# EAGLE design fan-host-board-v1.0 (EAGLE 9.6.2)
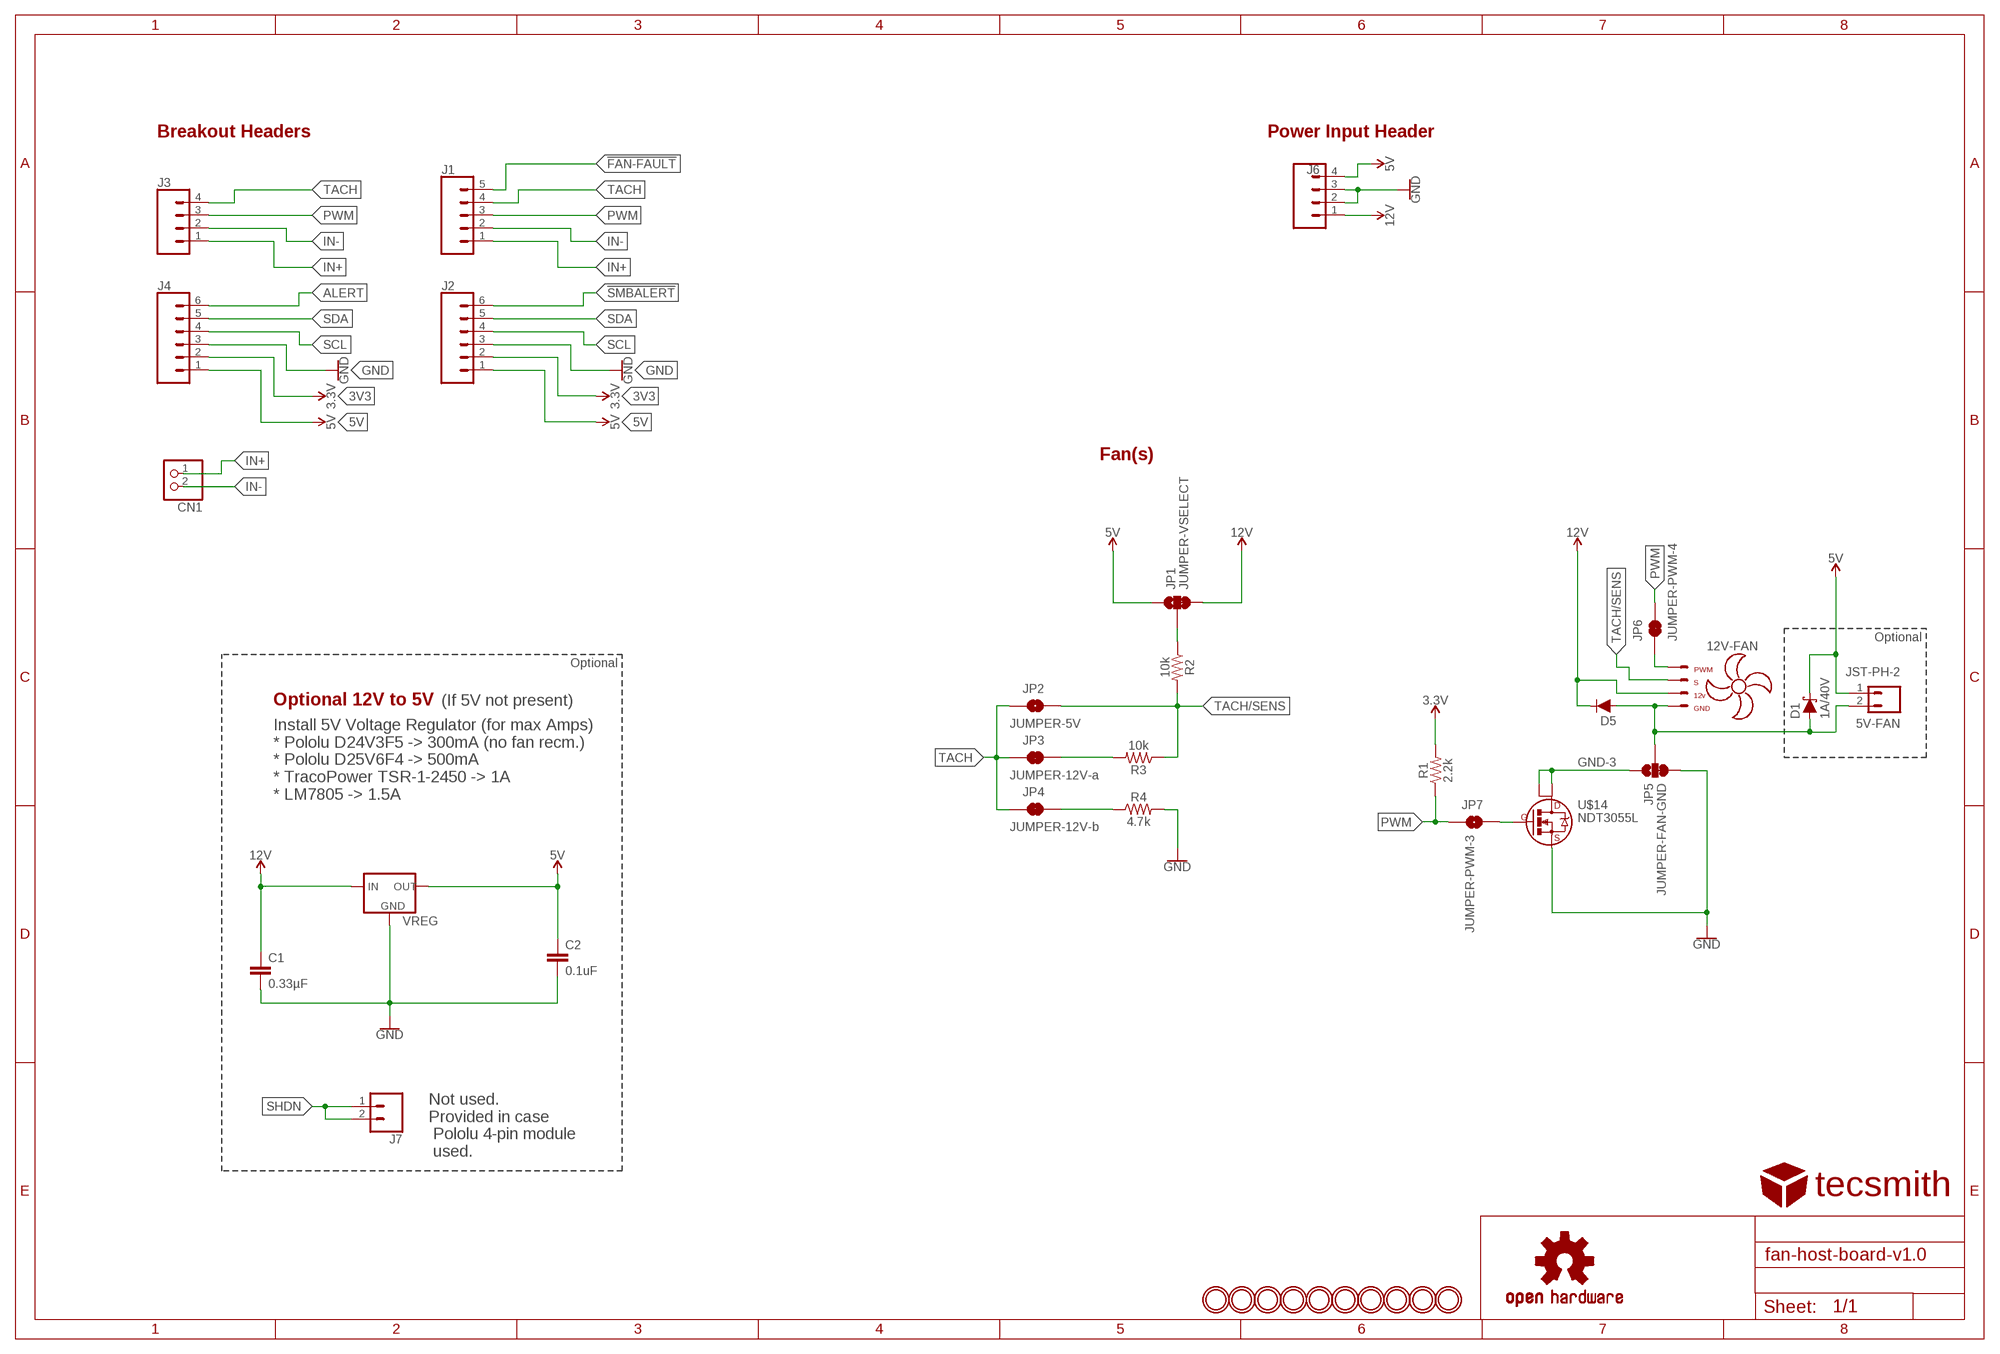
[diagram p0: schematic, sheet 1]

## Parts
5V-FAN  JST-PH-2  [JST-PH2]
12V-FAN  KK-254-4KK-254  [MOLEX_47053-1000]
C1  0.33µF  0.33UF/330NF-0805-50V-10%  [0805]
C2  0.1uF  0.1UF-0603-25V-5%  [0603]
CN1  JST_2PIN-THM  [JST-PH-2-THM]
D1  1A/40V  DIODE-SCHOTTKY-SS14  [SMA-DIODE]
D5  200mA/100V  DIODE-1N4148  [DIODE-1N4148]
J1  CONN_05  [1X05]
J2  CONN_06SILK_FEMALE_PTH  [1X06]
J3  CONN_04PTH  [1X04]
J4  CONN_06SILK_FEMALE_PTH  [1X06]
J6  CONN_04SCREW  [SCREWTERMINAL-3.5MM-4]
J7  CONN_021X02_NO_SILK  [1X02_NO_SILK]
JP1  JUMPER-VSELECT  JUMPER-SMT_3_1-NC_TRACE_SILK  [SMT-JUMPER_3_1-NC_TRACE_SILK]
JP2  JUMPER-5V  JUMPER-SMT_2_NO_NO_SILK  [SMT-JUMPER_2_NO_SILK]
JP3  JUMPER-12V-a  JUMPER-SMT_2_NC_TRACE_SILK  [SMT-JUMPER_2_NC_TRACE_SILK]
JP4  JUMPER-12V-b  JUMPER-SMT_2_NC_TRACE_SILK  [SMT-JUMPER_2_NC_TRACE_SILK]
JP5  JUMPER-FAN-GND  JUMPER-SMT_3_1-NC_TRACE_SILK  [SMT-JUMPER_3_1-NC_TRACE_SILK]
JP6  JUMPER-PWM-4  JUMPER-SMT_2_NC_TRACE_SILK  [SMT-JUMPER_2_NC_TRACE_SILK]
JP7  JUMPER-PWM-3  JUMPER-SMT_2_NO_NO_SILK  [SMT-JUMPER_2_NO_SILK]
LOGO1  OSHW-LOGOS  [OSHW-LOGO-S]
R1  2.2k  2.2KOHM-0603-1/10W-1%  [0603]
R2  10k  10KOHM-0603-1/10W-1%  [0603]
R3  10k  10KOHM-0603-1/10W-1%  [0603]
R4  4.7k  4.7KOHM-0603-1/10W-1%  [0603]
U$1  TECSMITH-LOGO  [TECSMITH-LOGO]
U$3  MOUNTINGHOLE2.5  [MOUNTINGHOLE_2.5_PLATED]
U$4  MOUNTINGHOLE2.5  [MOUNTINGHOLE_2.5_PLATED]
U$5  MOUNTINGHOLE2.5  [MOUNTINGHOLE_2.5_PLATED]
U$6  MOUNTINGHOLE2.5  [MOUNTINGHOLE_2.5_PLATED]
U$7  MOUNTINGHOLE2.5  [MOUNTINGHOLE_2.5_PLATED]
U$8  MOUNTINGHOLE2.5  [MOUNTINGHOLE_2.5_PLATED]
U$9  MOUNTINGHOLE2.5  [MOUNTINGHOLE_2.5_PLATED]
U$10  MOUNTINGHOLE2.5  [MOUNTINGHOLE_2.5_PLATED]
U$11  MOUNTINGHOLE2.5  [MOUNTINGHOLE_2.5_PLATED]
U$12  MOUNTINGHOLE2.5  [MOUNTINGHOLE_2.5_PLATED]
U$14  NDT3055L  [SOT223]
VREG  TRACOPOWER-TSR-1  [TRACO-TSR-1]

## Nets
3V3: J2.2 J4.2 R1.2 ; supply symbol labelled 3.3V
5V: 5V-FAN.1 C2.1 D1.C J2.1 J4.1 J6.4 JP1.1 VREG.P$+VOUT(OUT)
12V: 12V-FAN.2:+12VDC C1.1 D5.C J6.1 JP1.3 VREG.P$+VIN(IN)
!FAN-FAULT: J1.5
!SMBALERT: J2.6
ALERT: J4.6
GND: C1.2 C2.2 J2.3 J4.3 J6.2 J6.3 JP5.3 R4.2 U$14.S VREG.P$GND(GND)
GND-3: JP5.1 U$14.D U$14.D2
GND-F: 5V-FAN.2 12V-FAN.1:GND D1.A D5.A JP5.2
IN+: CN1.1 J1.1 J3.1
IN-: CN1.2 J1.2 J3.2
N$2: JP7.2 U$14.G
N$4: JP1.2 R2.1
N$5: JP3.2 R3.2
N$6: JP4.2 R4.1
PWM: J1.3 J3.3 JP6.2 JP7.1 R1.1
PWM-F: 12V-FAN.4:PWM JP6.1
SCL: J2.4 J4.4
SDA: J2.5 J4.5
SHDN: J7.1 J7.2
TACH: J1.4 J3.4 JP2.1 JP3.1 JP4.1
TACH/SENS: 12V-FAN.3:TACH JP2.2 R2.2 R3.1

## Notes on the sheet
- Breakout Headers | Power Input Header
- Fan(s)
- Optional
- Optional
- Optional 12V to 5V | (If 5V not present)
- Install 5V Voltage Regulator (for max Amps)
  * Pololu D24V3F5 -> 300mA (no fan recm.)
  * Pololu D25V6F4 -> 500mA
  * TracoPower TSR-1-2450 -> 1A
  * LM7805 -> 1.5A
- Not used.
  Provided in case
   Pololu 4-pin module
   used.

## Library data of the parts
5V-FAN = VinoRodrigues_Custom_Eagle:JST-PH-2
12V-FAN = VinoRodrigues_Custom_Eagle:KK-254-4
C1 = SparkFun-Capacitors:0.33UF/330NF: 0.33µF/330nF ceramic capacitors A capacitor is a passive two-terminal electrical component used to store electrical energy temporarily in an electric field.; PROD_ID: CAP-08469
C2 = SparkFun-Capacitors:0.1UF: 0.1µF ceramic capacitors A capacitor is a passive two-terminal electrical component used to store electrical energy temporarily in an electric field.; PROD_ID: CAP-08604
CN1 = adafruit:JST_2PIN: JST 2-Pin Connectors of various flavors SMT-RA (S2B-PH-SM4) 4UConnector #17311 SMT (B2B-PH-SM4) THM-RA (S2B-PH) THM (B2B-PH)
D1 = SparkFun-DiscreteSemi:DIODE-SCHOTTKY: Schottky diode A Schottky diode is a semiconductor diode which has a low forward voltage drop and a very fast switching action.; PROD_ID: DIO-08053; VALUE: 1A/40V/500mV
D5 = SparkFun-DiscreteSemi:DIODE: Diode These are standard reverse protection diodes and small signal diodes. SparkFun Products: SparkFun SparkPunk Sound Kit <https://www.sparkfun.com/products/11177> SparkFun ESP8266 Thing <https://www.sparkfun.com/products/13231>; PROD_ID: DIO-08378; VALUE: 200mA/100V/1V
J1 = SparkFun-Connectors:CONN_05: Multi connection point. Often used as Generic Header-pin footprint for 0.1 inch spaced/style header connections On any of the 0.1 inch spaced packages, you can populate with these: Break Away Headers - Straight <https://www.sparkfun.com/products/116> (PRT-00116) Break Away Male Headers - Right Angle <https://www.sparkfun.com/products/553> (PRT-00553) Female Headers <https://www.sparkfun.com/products/115> (PRT-00115) Break Away Headers - Machine Pin <https://www.sparkfun.com/products/117> (PRT-00117) Break Away Female Headers - Swiss Machine Pin <https://www.sparkfun.com/products/743> (PRT-00743) For SCREWTERMINALS and SPRING TERMINALS visit here: Screw Terimnals on SparkFun.com <https://www.sparkfun.com/search/results?term=Screw+Terminals> (5mm/3.5mm/2.54mm spacing) This device is also useful as a general connection point to wire up your design to another part of your project. Our various solder wires solder well into these plated through hole pads. Hook-Up Wire - Assortment (Stranded, 22 AWG) <https://www.sparkfun.com/products/11375> (PRT-11375) Hook-Up Wire - Assortment (Solid Core, 22 AWG) <https://www.sparkfun.com/products/11367> (PRT-11367) View the entire wire category on our website here <https://www.sparkfun.com/categories/141> Special notes: Molex polarized connector foot print use with SKU : PRT-08231 with associated crimp pins and housings. 1MM SMD Version SKU: PRT-10208
J2 J4 = SparkFun-Connectors:CONN_06: Multi connection point. Often used as Generic Header-pin footprint for 0.1 inch spaced/style header connections On any of the 0.1 inch spaced packages, you can populate with these: Break Away Headers - Straight <https://www.sparkfun.com/products/116> (PRT-00116) Break Away Male Headers - Right Angle <https://www.sparkfun.com/products/553> (PRT-00553) Female Headers <https://www.sparkfun.com/products/115> (PRT-00115) Break Away Headers - Machine Pin <https://www.sparkfun.com/products/117> (PRT-00117) Break Away Female Headers - Swiss Machine Pin <https://www.sparkfun.com/products/743> (PRT-00743) Arduino Stackable Header - 6 Pin <https://www.sparkfun.com/products/9280> (PRT-09280) For SCREWTERMINALS and SPRING TERMINALS visit here: Screw Terimnals on SparkFun.com <https://www.sparkfun.com/search/results?term=Screw+Terminals> (5mm/3.5mm/2.54mm spacing) This device is also useful as a general connection point to wire up your design to another part of your project. Our various solder wires solder well into these plated through hole pads. Hook-Up Wire - Assortment (Stranded, 22 AWG) <https://www.sparkfun.com/products/11375> (PRT-11375) Hook-Up Wire - Assortment (Solid Core, 22 AWG) <https://www.sparkfun.com/products/11367> (PRT-11367) View the entire wire category on our website here <https://www.sparkfun.com/categories/141>; PROD_ID: CONN-08437
J3 = SparkFun-Connectors:CONN_04: Multi connection point. Often used as Generic Header-pin footprint for 0.1 inch spaced/style header connections On any of the 0.1 inch spaced packages, you can populate with these: Break Away Headers - Straight <https://www.sparkfun.com/products/116> (PRT-00116) Break Away Male Headers - Right Angle <https://www.sparkfun.com/products/553> (PRT-00553) Female Headers <https://www.sparkfun.com/products/115> (PRT-00115) Break Away Headers - Machine Pin <https://www.sparkfun.com/products/117> (PRT-00117) Break Away Female Headers - Swiss Machine Pin <https://www.sparkfun.com/products/743> (PRT-00743) For SCREWTERMINALS and SPRING TERMINALS visit here: Screw Terimnals on SparkFun.com <https://www.sparkfun.com/search/results?term=Screw+Terminals> (5mm/3.5mm/2.54mm spacing) This device is also useful as a general connection point to wire up your design to another part of your project. Our various solder wires solder well into these plated through hole pads. Hook-Up Wire - Assortment (Stranded, 22 AWG) <https://www.sparkfun.com/products/11375> (PRT-11375) Hook-Up Wire - Assortment (Solid Core, 22 AWG) <https://www.sparkfun.com/products/11367> (PRT-11367) View the entire wire category on our website here <https://www.sparkfun.com/categories/141> Special notes: Molex polarized connector foot print use with SKU : PRT-08231 with associated crimp pins and housings. 1MM SMD Version SKU: PRT-10208; PROD_ID: CONN-09696
J6 = SparkFun-Connectors:CONN_04: Multi connection point. Often used as Generic Header-pin footprint for 0.1 inch spaced/style header connections On any of the 0.1 inch spaced packages, you can populate with these: Break Away Headers - Straight <https://www.sparkfun.com/products/116> (PRT-00116) Break Away Male Headers - Right Angle <https://www.sparkfun.com/products/553> (PRT-00553) Female Headers <https://www.sparkfun.com/products/115> (PRT-00115) Break Away Headers - Machine Pin <https://www.sparkfun.com/products/117> (PRT-00117) Break Away Female Headers - Swiss Machine Pin <https://www.sparkfun.com/products/743> (PRT-00743) For SCREWTERMINALS and SPRING TERMINALS visit here: Screw Terimnals on SparkFun.com <https://www.sparkfun.com/search/results?term=Screw+Terminals> (5mm/3.5mm/2.54mm spacing) This device is also useful as a general connection point to wire up your design to another part of your project. Our various solder wires solder well into these plated through hole pads. Hook-Up Wire - Assortment (Stranded, 22 AWG) <https://www.sparkfun.com/products/11375> (PRT-11375) Hook-Up Wire - Assortment (Solid Core, 22 AWG) <https://www.sparkfun.com/products/11367> (PRT-11367) View the entire wire category on our website here <https://www.sparkfun.com/categories/141> Special notes: Molex polarized connector foot print use with SKU : PRT-08231 with associated crimp pins and housings. 1MM SMD Version SKU: PRT-10208; PROD_ID: CONN-14485
J7 = SparkFun-Connectors:CONN_02: Multi connection point. Often used as Generic Header-pin footprint for 0.1 inch spaced/style header connections On any of the 0.1 inch spaced packages, you can populate with these: Break Away Headers - Straight <https://www.sparkfun.com/products/116> (PRT-00116) Break Away Male Headers - Right Angle <https://www.sparkfun.com/products/553> (PRT-00553) Female Headers <https://www.sparkfun.com/products/115> (PRT-00115) Break Away Headers - Machine Pin <https://www.sparkfun.com/products/117> (PRT-00117) Break Away Female Headers - Swiss Machine Pin <https://www.sparkfun.com/products/743> (PRT-00743) For SCREWTERMINALS and SPRING TERMINALS visit here: Screw Terimnals on SparkFun.com <https://www.sparkfun.com/search/results?term=Screw+Terminals> (5mm/3.5mm/2.54mm spacing) This device is also useful as a general connection point to wire up your design to another part of your project. Our various solder wires solder well into these plated through hole pads. Hook-Up Wire - Assortment (Stranded, 22 AWG) <https://www.sparkfun.com/products/11375> (PRT-11375) Hook-Up Wire - Assortment (Solid Core, 22 AWG) <https://www.sparkfun.com/products/11367> (PRT-11367) View the entire wire category on our website here <https://www.sparkfun.com/categories/141> Special notes: Molex polarized connector foot print use with: PRT-08233 with associated crimp pins and housings. 2.54_SCREWTERM for use with PRT-10571. 3.5mm Screw Terminal footprints for PRT-08084 5mm Screw Terminal footprints for use with PRT-08432
JP1 JP5 = SparkFun-Jumpers:JUMPER-SMT_3_1-NC_TRACE: Normally closed trace jumper (1 of 2 connections) This jumper has a trace between two pads so it's normally closed (NC). The other connection is normally open (NO). Use a razor knife to open the connection. For best results follow the IPC guidelines for cutting traces: Cutout at least 0.063 mm (0.005 in). Remove all loose material to clean up the cut area. Seal the cut with an approved epoxy. Reapply solder to reclose the connection, or to close the NO connection.
JP2 JP7 = VinoRodrigues_Custom_Eagle:JUMPER-SMT_2_NO
JP3 JP4 JP6 = SparkFun-Jumpers:JUMPER-SMT_2_NC_TRACE: Normally closed trace jumper This jumper has a trace between two pads so it's normally closed (NC). Use a razor knife to open the connection. For best results follow the IPC guidelines for cutting traces: Cutout at least 0.063 mm (0.005 in). Remove all loose material to clean up the cut area. Seal the cut with an approved epoxy. Reapply solder to reclose the connection.
LOGO1 = SparkFun-Aesthetics:OSHW-LOGO: Open-Source Hardware (OSHW) Logo This logo indicates the piece of hardware it is found on incorporates a OSHW license and/or adheres to the definition of open source hardware found here: http://freedomdefined.org/OSHW
R1 = SparkFun-Resistors:2.2KOHM: 2.2kΩ resistor A resistor is a passive two-terminal electrical component that implements electrical resistance as a circuit element. Resistors act to reduce current flow, and, at the same time, act to lower voltage levels within circuits. - Wikipedia; PROD_ID: RES-08272
R2 R3 = SparkFun-Resistors:10KOHM: 10kΩ resistor A resistor is a passive two-terminal electrical component that implements electrical resistance as a circuit element. Resistors act to reduce current flow, and, at the same time, act to lower voltage levels within circuits. - Wikipedia; PROD_ID: RES-00824
R4 = SparkFun-Resistors:4.7KOHM: 4.7kΩ resistor A resistor is a passive two-terminal electrical component that implements electrical resistance as a circuit element. Resistors act to reduce current flow, and, at the same time, act to lower voltage levels within circuits. - Wikipedia; PROD_ID: RES-07857
U$1 = VinoRodrigues_Custom_Eagle:TECSMITH-LOGO
U$3-U$12 = microbuilder:MOUNTINGHOLE: Mounting Hole For #2 screws (0.086"/2.18mm width, 0.094"/2.4mm hole) use 2.5mm; BOM: EXCLUDE
U$14 = VinoRodrigues_Custom_Eagle:NDT3055L
VREG = VinoRodrigues_Custom_Eagle:TRACOPOWER-TSR-1

## Board
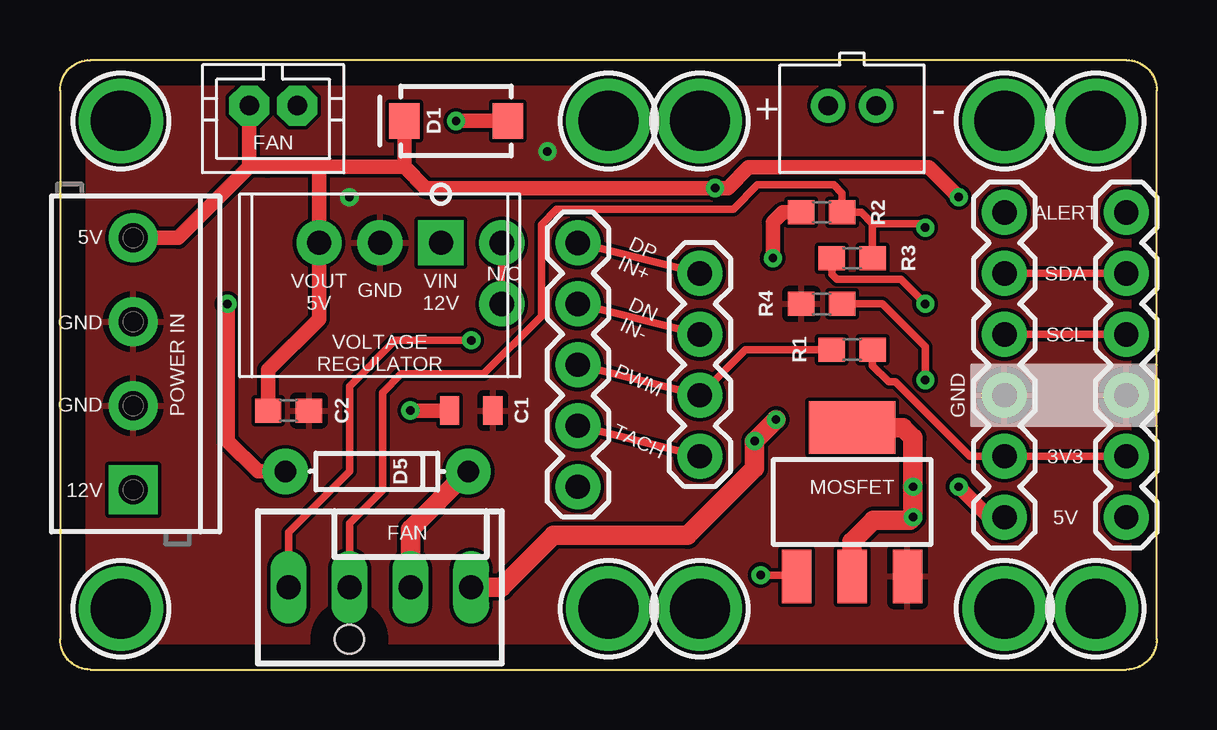
[diagram p1: board, top side]
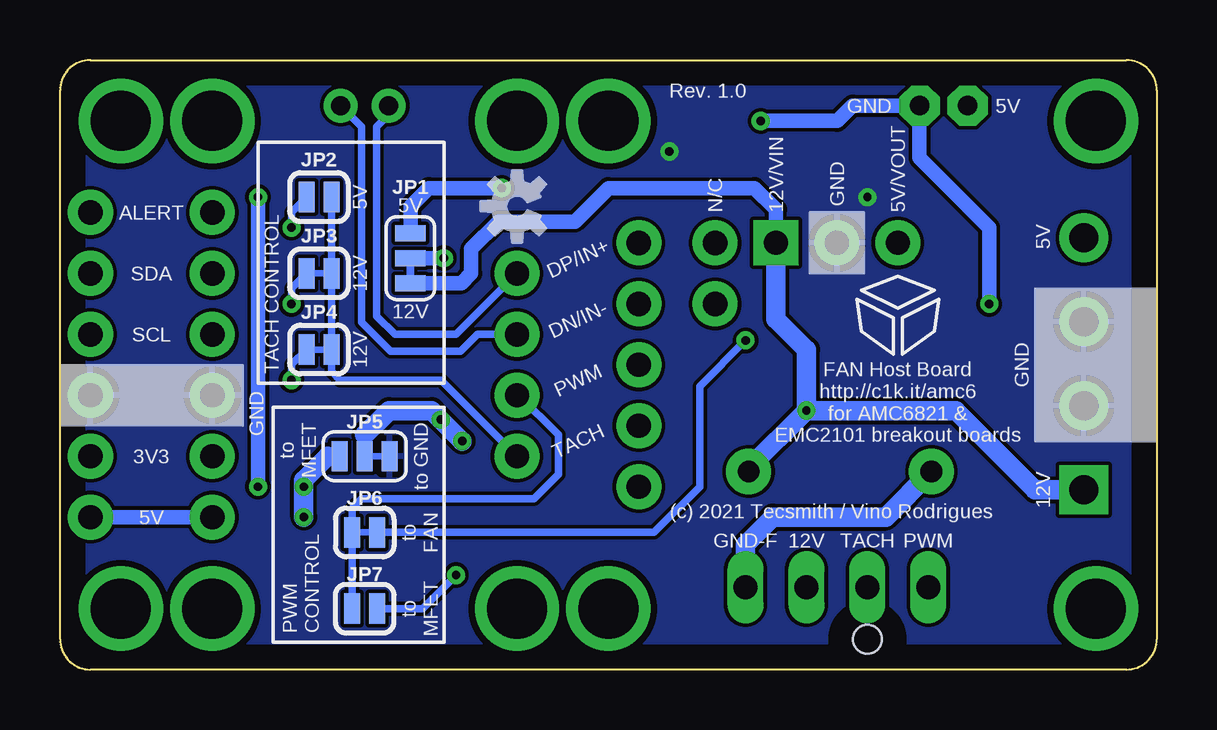
[diagram p2: board, bottom side, seen from below]

Size 45.72 x 25.4 mm. Coordinates in mm from the lower left corner, seen from the top.
Outline: 1.27,0 44.45,0 arc90 45.72,1.27 45.72,24.13 arc90 44.45,25.4 1.27,25.4 arc90 0,24.13 0,1.27 arc90 1.27,0
Copper layers (1*16): Top 0.035mm / dielectric 1.5mm / Bottom 0.035mm
Design rules "default": minimum track width 6mil, minimum drill 0.35mm, track to track 6mil, track to pad 6mil, pad to pad 6mil, via to via 6mil, smd to smd 6mil, copper to edge 40mil, drill to drill 6mil, minimum pad ring 10mil, minimum via ring 8mil, stop-mask expansion 4mil, vias tented up to drill 0mil, thermal gap 10mil

### Footprints (pad centres in the part's own frame; a part is rotated, then mirrored left to right if it is on the bottom)
JST-PH2 = drill 0.813 pad 1.676 octagon: 1 1,0; 2 -1,0
MOLEX_47053-1000 = drill 1 long: 1:GND 3.81,0; 2:+12VDC 1.27,0; 3:TACH -1.27,0; 4:PWM -3.81,0 | hole 1.2: -1.27,-2.159
0805 = smd 0.8 x 1.2: 1 -0.9,0; 2 0.9,0
0603 = smd 1.1 x 1: 1 -0.85,0; 2 0.85,0
JST-PH-2-THM = drill 0.8 pad 1.422: 1 1,0; 2 -1,0
SMA-DIODE = smd 1.27 x 1.47: A -2.15,0; C 2.15,0
DIODE-1N4148 = drill 0.9 pad 1.88: A -3.81,0; C 3.81,0
1X05 = drill 1.016 pad 1.88: 1 0,0; 2 2.54,0; 3 5.08,0; 4 7.62,0; 5 10.16,0
1X06 = drill 1.016 pad 1.88: 1 0,0; 2 2.54,0; 3 5.08,0; 4 7.62,0; 5 10.16,0; 6 12.7,0
1X04 = drill 1.016 pad 1.88: 1 0,0; 2 2.54,0; 3 5.08,0; 4 7.62,0
SCREWTERMINAL-3.5MM-4 = drill 1.2 pad 2.032 square: 1 0,0 | drill 1.2 pad 2.032: 2 3.5,0; 3 7,0; 4 10.5,0
1X02_NO_SILK = drill 1.016 pad 1.88: 1 0,0; 2 2.54,0
SMT-JUMPER_3_1-NC_TRACE_SILK = smd 0.66 x 1.27: 1 -1.041,0; 2 0,0; 3 1.041,0
SMT-JUMPER_2_NO_SILK = smd 0.66 x 1.27: 1 -0.521,0; 2 0.521,0
SMT-JUMPER_2_NC_TRACE_SILK = smd 0.66 x 1.27: 1 -0.521,0; 2 0.521,0
MOUNTINGHOLE_2.5_PLATED = drill 2.5 pad 3.2: P$1 0,0
SOT223 = smd 1.219 x 2.235: D 0,-3.099; G -2.311,-3.099; S 2.311,-3.099 | smd 3.6 x 2.2: D2 0,3.099
TRACO-TSR-1 = drill 1 pad 1.88 square: P$+VIN -2.54,0 | drill 1 pad 1.88: P$+VOUT 2.54,0; P$GND 0,0

### Placement (x,y rotation side)
5V-FAN  8.89,23.5 180 top
12V-FAN  13.34,3.43 0 top
C1  17.14,10.79 0 top
C2  9.53,10.79 0 top
CN1  33.02,23.5 180 top
D1  16.51,22.86 180 top
D5  13.21,8.26 0 top
J1  21.59,17.78 270 top
J2  44.45,6.35 90 top
J3  26.67,16.51 270 top
J4  39.37,6.35 90 top
J6  3.05,7.49 90 top
J7  18.41,15.24 90 top
JP1  31.11,17.14 270 bottom
JP2  34.92,19.68 180 bottom
JP3  34.92,16.51 180 bottom
JP4  34.92,13.34 180 bottom
JP5  33.02,8.89 0 bottom
JP6  33.02,5.71 180 bottom
JP7  33.02,2.54 0 bottom
LOGO1  26.67,19.3 90 bottom
R1  33.02,13.34 0 top
R2  31.75,19.05 0 top
R3  33.02,17.14 180 top
R4  31.75,15.24 180 top
U$1  10.79,14.86 0 bottom
U$3  26.67,2.54 0 top
U$4  2.54,2.54 0 top
U$5  2.54,22.86 0 top
U$6  22.86,2.54 0 top
U$7  22.86,22.86 0 top
U$8  43.18,2.54 0 top
U$9  43.18,22.86 0 top
U$10  26.67,22.86 0 top
U$11  39.37,2.54 0 top
U$12  39.37,22.86 0 top
U$14  33.02,6.99 0 top
VREG  13.34,17.78 180 top

### Tracks (layer width: path | path; a pad name or v marks a point on that pad's centre or on a via)
3V3
  Top 0.305: J2.2 J4.2 37.93,8.89 34.82,12 34.54,12 33.87,12.67 R1.2
5V  (via drill 0.35)
  Top 0.61: C2.1 8.68,12.48 10.79,14.61 VREG.P$+VOUT 10.79,20.95 | J6.4 4.93,17.99 7.89,20.95 | D1.C 14.36,20.95 | 14.36,20.95 15.24,20.07 v27.3,20.07 27.84,20.07 28.7,20.93 36.22,20.93 v37.47,19.68 | 14.36,20.95 10.79,20.95 | 10.79,20.95 8.64,20.95 7.89,20.95 | 7.89,20.95 5V-FAN.1 | v37.47,7.62 38.73,6.35 J4.1
  Bottom 0.305: 39.24,6.35 J4.1
  Bottom 0.61: J4.1 J2.1 | JP1.1 31.11,19.3 30.35,20.07 v27.3,20.07 | v37.47,19.68 v37.47,7.62
12V  (via drill 0.35)
  Top 0.61: v14.61,10.79 C1.1
  Top 0.813: 12V-FAN.2:+12VDC 14.61,5.84 D5.C
  Bottom 0.305: 17.02,8.38 D5.C
  Bottom 0.61: VREG.P$+VIN 15.88,19.18 16.76,20.07 22.86,20.07 24.26,18.67 27.43,18.67 28.57,17.53 28.57,16.51 28.98,16.1 JP1.3
  Bottom 0.813: v14.61,10.79 14.61,13.34 15.88,14.61 VREG.P$+VIN | v14.61,10.79 8.38,10.79 5.08,7.49 J6.1 | v14.61,10.79 17.02,8.38
GND  (via drill 0.35)
  other vias: 20.32,21.59 12.06,19.68
  pour Top: 0,0 0,25.4 45.72,25.4 45.72,0
  pour Bottom: 0,0 0,25.4 45.72,25.4 45.72,0
GND-3  (via drill 0.35)
  Top 0.813: v35.56,6.35 35.43,6.22 33.91,6.22 33.02,5.33 U$14.D | v35.56,6.35 35.56,9.65 35.13,10.08 U$14.D2 | v35.56,7.62 v35.56,6.35
  Bottom 0.61: JP5.1 34.57,8.89
  Bottom 0.813: v35.56,6.35 35.56,7.9 34.57,8.89
GND-F  (via drill 0.35)
  Top 0.61: D5.A 8.26,8.26 6.99,9.53 v6.99,15.24 | v16.51,22.86 D1.A
  Top 0.813: 12V-FAN.1:GND 18.41,3.43 20.57,5.59 26.16,5.59 28.96,8.38 v28.96,9.53 v29.84,10.41
  Bottom 0.61: v6.99,15.24 6.99,18.41 9.89,21.32 5V-FAN.2 12.68,23.5 13.32,22.86 v16.51,22.86 | JP5.2 33.02,9.78
  Bottom 0.813: 12V-FAN.1:GND 17.14,5.21 16,6.35 11.3,6.35 D5.A | 33.02,9.78 32,10.79 30.23,10.79 v28.96,9.53
IN+
  Top 0.305: J1.1 J3.1
  Bottom 0.305: J3.1 29.21,13.97 31.75,13.97 32.51,14.73 32.51,22.62 32.02,23.11 CN1.1
IN-
  Top 0.305: J1.2 J3.2
  Bottom 0.305: J3.2 28.31,13.97 29.02,13.26 31.94,13.26 33.15,14.47 33.15,22.62 CN1.2
N$2  (via drill 0.35)
  Top 0.305: U$14.G 30.73,3.91 30.73,3.94 v29.21,3.94
  Bottom 0.305: JP7.2 30.61,2.54 v29.21,3.94
N$4  (via drill 0.35)
  Top 0.61: v29.72,17.14 29.72,18.63 30.14,19.05 R2.1
  Bottom 0.61: v29.72,17.14 JP1.2
N$5  (via drill 0.35)
  Top 0.305: R3.2 32.17,16.47 32.38,16.26 35.05,16.26 v36.07,15.24
  Bottom 0.305: JP3.2 36.07,15.89 v36.07,15.24
N$6  (via drill 0.35)
  Top 0.305: R4.1 34.29,15.24 36.07,13.46 v36.07,12.06
  Bottom 0.305: JP4.2 36.07,12.71 v36.07,12.06
PWM
  Top 0.305: R1.1 28.57,13.34 J3.3 J1.3
  Bottom 0.305: J3.3 26.6,11.43 24.94,9.78 24.94,8.13 25.96,7.11 33.15,7.11 33.54,6.72 JP6.2 JP7.1
PWM-F  (via drill 0.35)
  Top 0.305: 12V-FAN.4:PWM 9.53,5.71 12.06,8.26 12.06,11.81 13.97,13.72 v17.14,13.72
  Bottom 0.305: v17.14,13.72 19.05,11.81 19.05,7.62 20.95,5.71 JP6.1
SCL
  Top 0.305: J4.4 J2.4
SDA
  Top 0.305: J4.5 J2.5
SHDN
  Top 0.305: J7.2 J7.1
TACH
  Top 0.305: J1.4 J3.4
  Bottom 0.305: J3.4 29.84,12.06 34.04,12.06 34.4,12.43 JP4.1 JP3.1 JP2.1
TACH/SENS  (via drill 0.35)
  Top 0.305: 12V-FAN.3:TACH 12.06,6.1 13.44,7.47 13.44,11.53 14.22,12.32 17.65,12.32 20.07,14.73 20.07,18.54 20.7,19.18 28.07,19.18 29.08,20.19 32.26,20.19 32.6,19.85 R2.2 33.4,19.05 33.87,18.58 | 33.87,18.58 R3.1 | v36.07,18.41 35.9,18.58 33.87,18.58
  Bottom 0.305: JP2.2 36.07,19.06 v36.07,18.41

### Text on the board
tNames: FAN | ALERT | 5V | VOUT / 5V | VIN / 12V | N/C | DP / IN+ | SDA | GND | DN / IN- | GND | VOLTAGE / REGULATOR | SCL | POWER IN | PWM | GND | GND | TACH | 3V3 | MOSFET | 12V | FAN | 5V
bNames: Rev. 1.0 | 5V | GND | 5V | 5V/VOUT | GND | 12V/VIN | N/C | 5V | ALERT | 5V | DP/IN+ | 12V | SDA | DN/IN- | 12V | SCL | GND | FAN Host Board / http://c1k.it/amc6 / for AMC6821 & / EMC2101 breakout boards | 12V | PWM | TACH CONTROL | GND | TACH | to GND | to / MFET | 3V3 | 12V | (c) 2021 Tecsmith / Vino Rodrigues | to / FAN | 5V | PWM | TACH | 12V | GND-F | to / MFET | PWM / CONTROL